# Altium schematic sheet 0113_AUDIO - SNDW2 for .SchDoc
size 848 x 558 mm
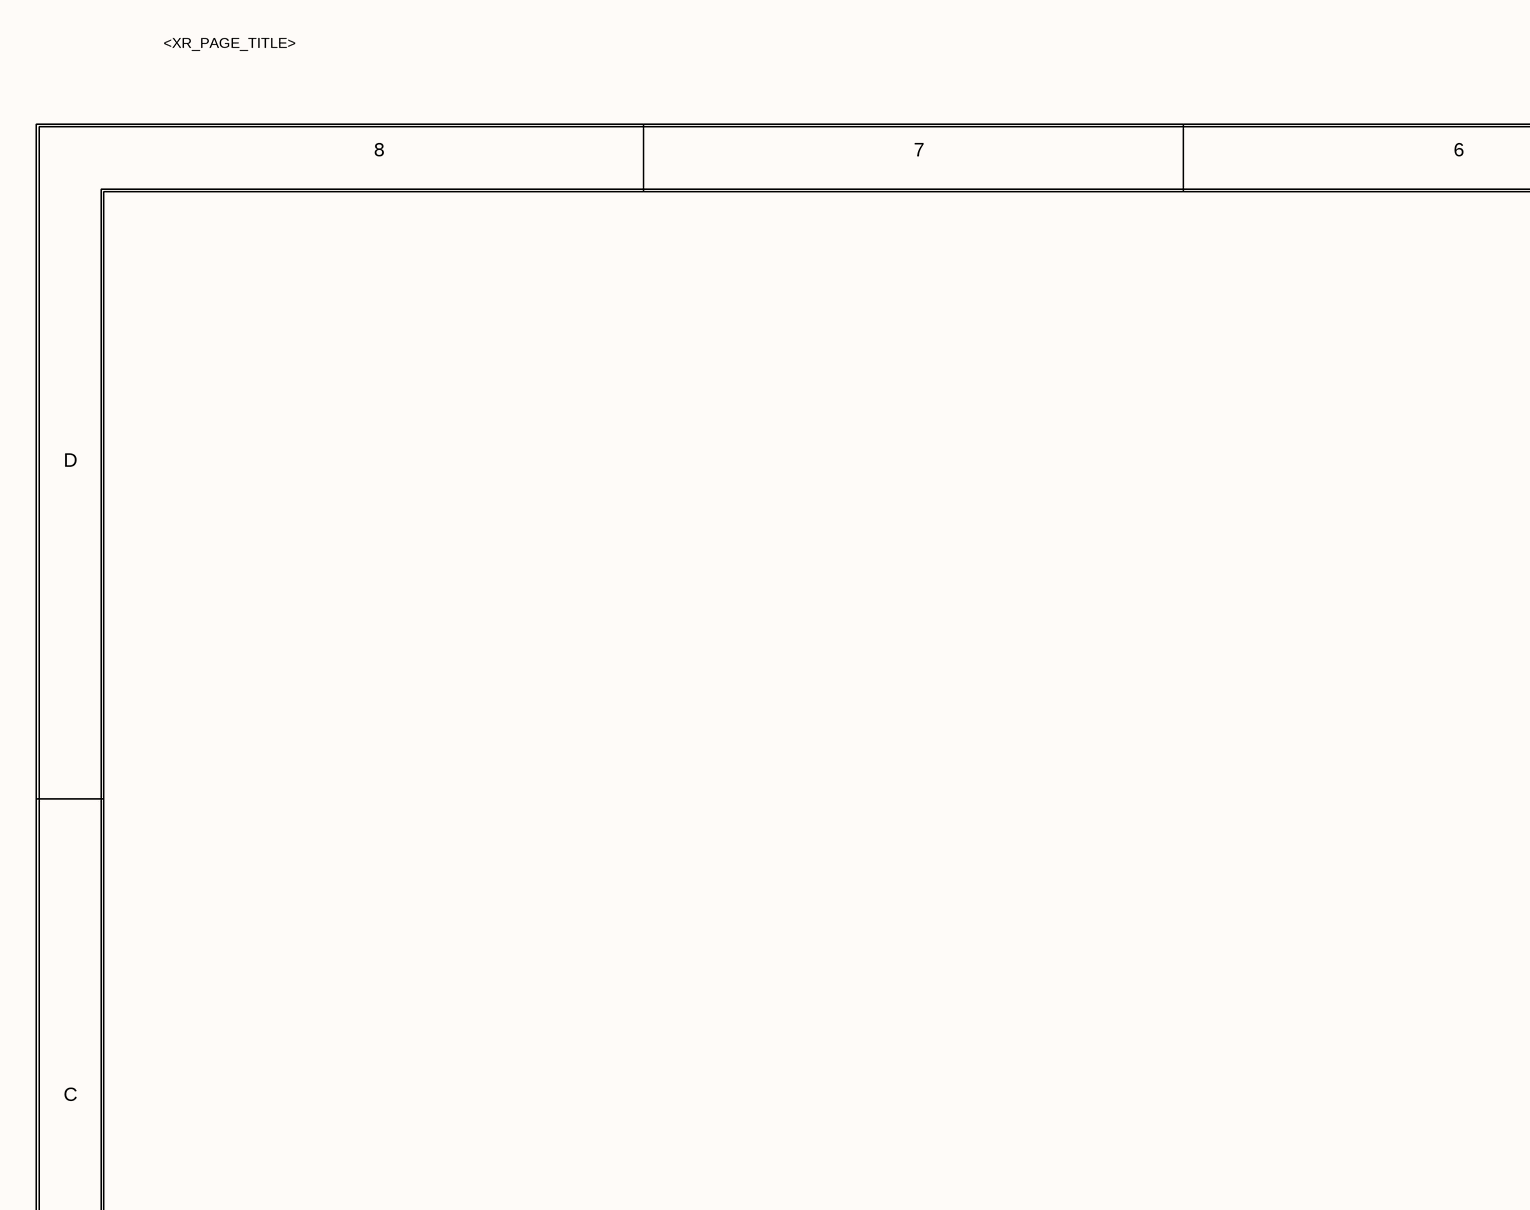
[diagram p0: 0113_AUDIO - SNDW2 for .SchDoc, top left]
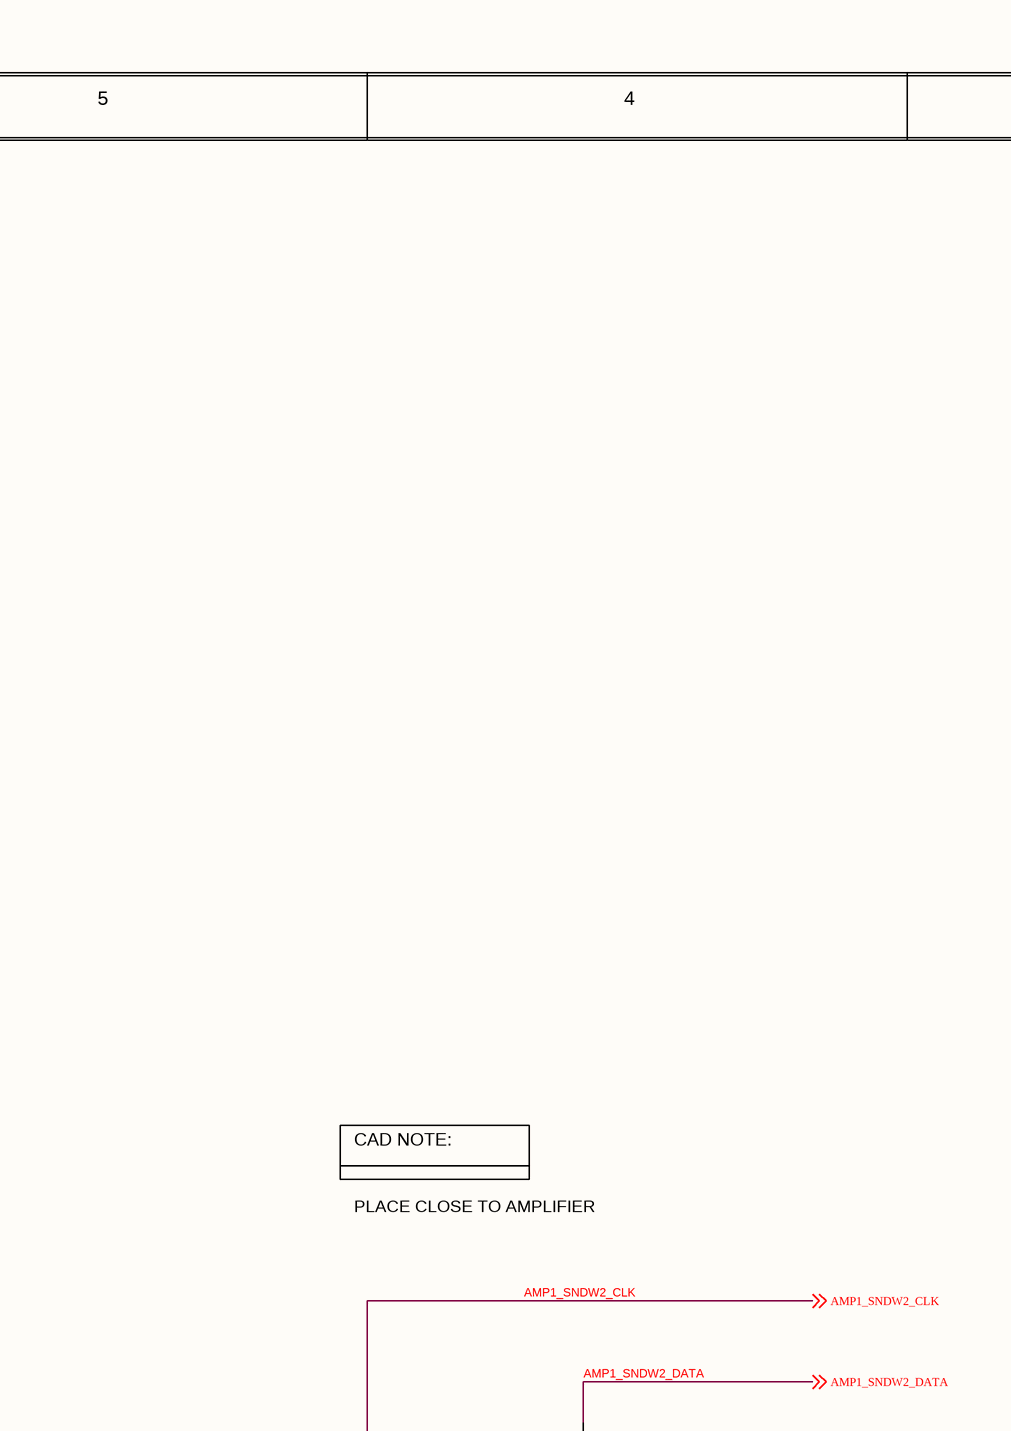
[diagram p1: 0113_AUDIO - SNDW2 for .SchDoc, top middle]
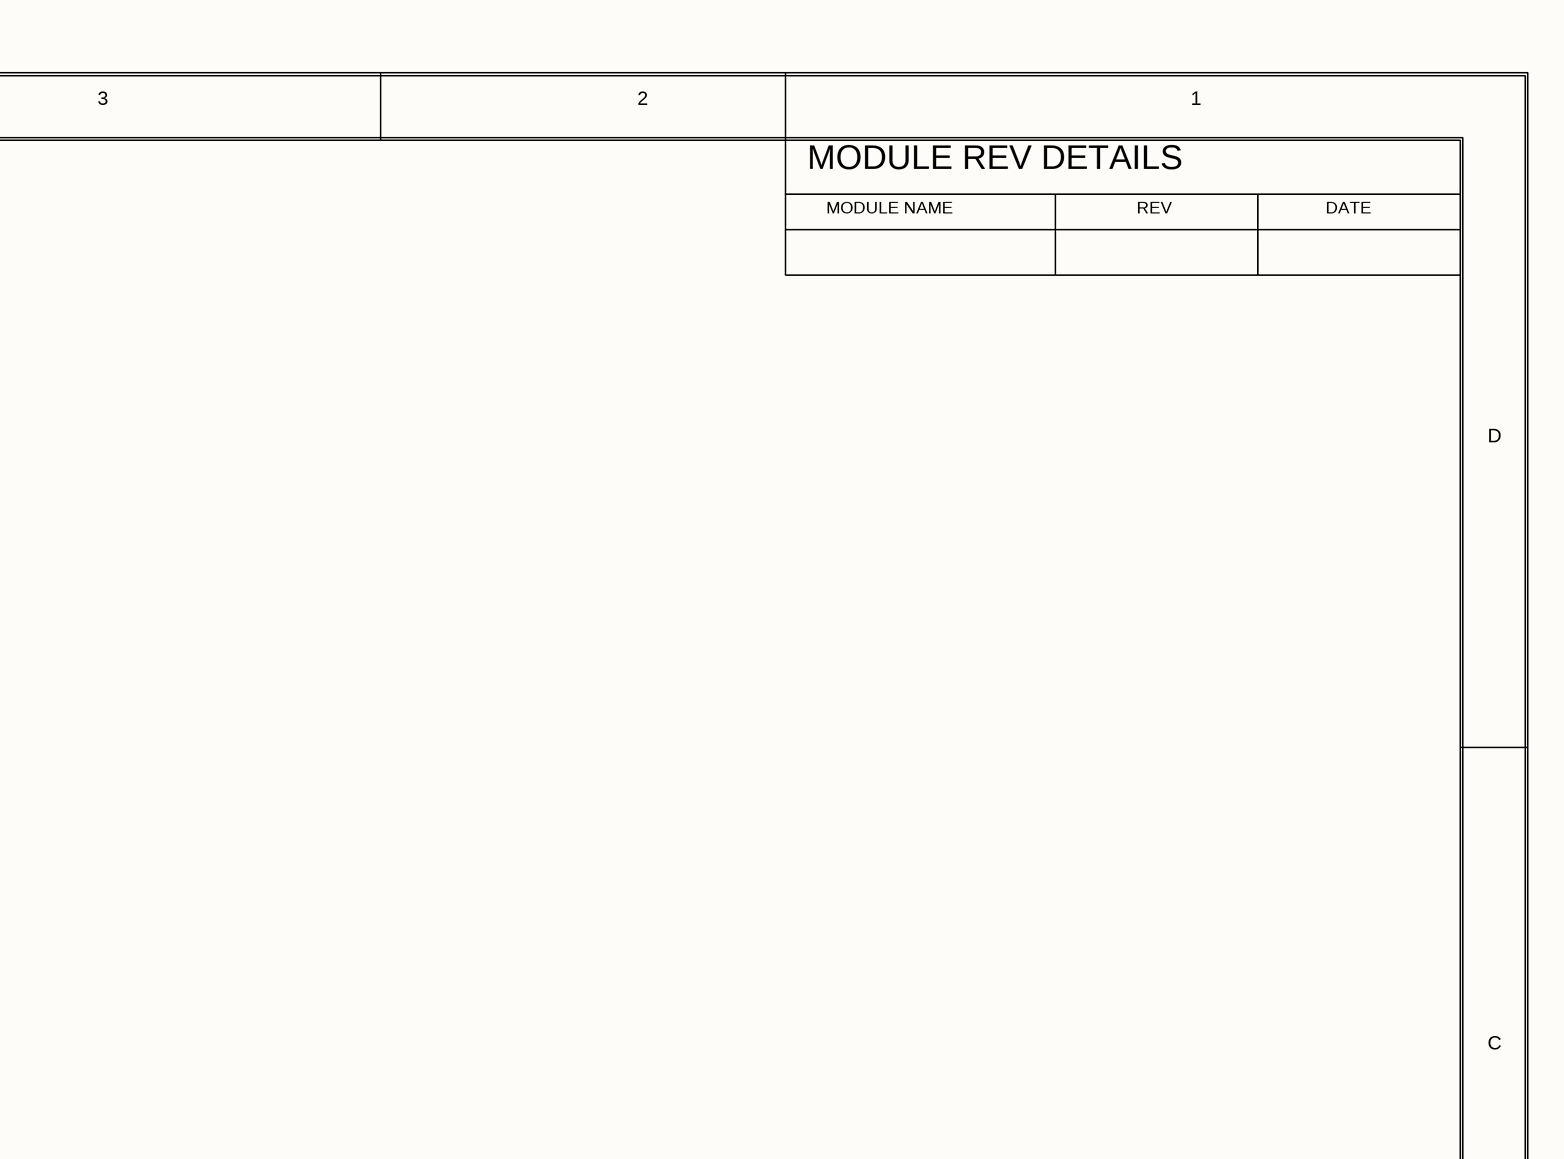
[diagram p2: 0113_AUDIO - SNDW2 for .SchDoc, top right]
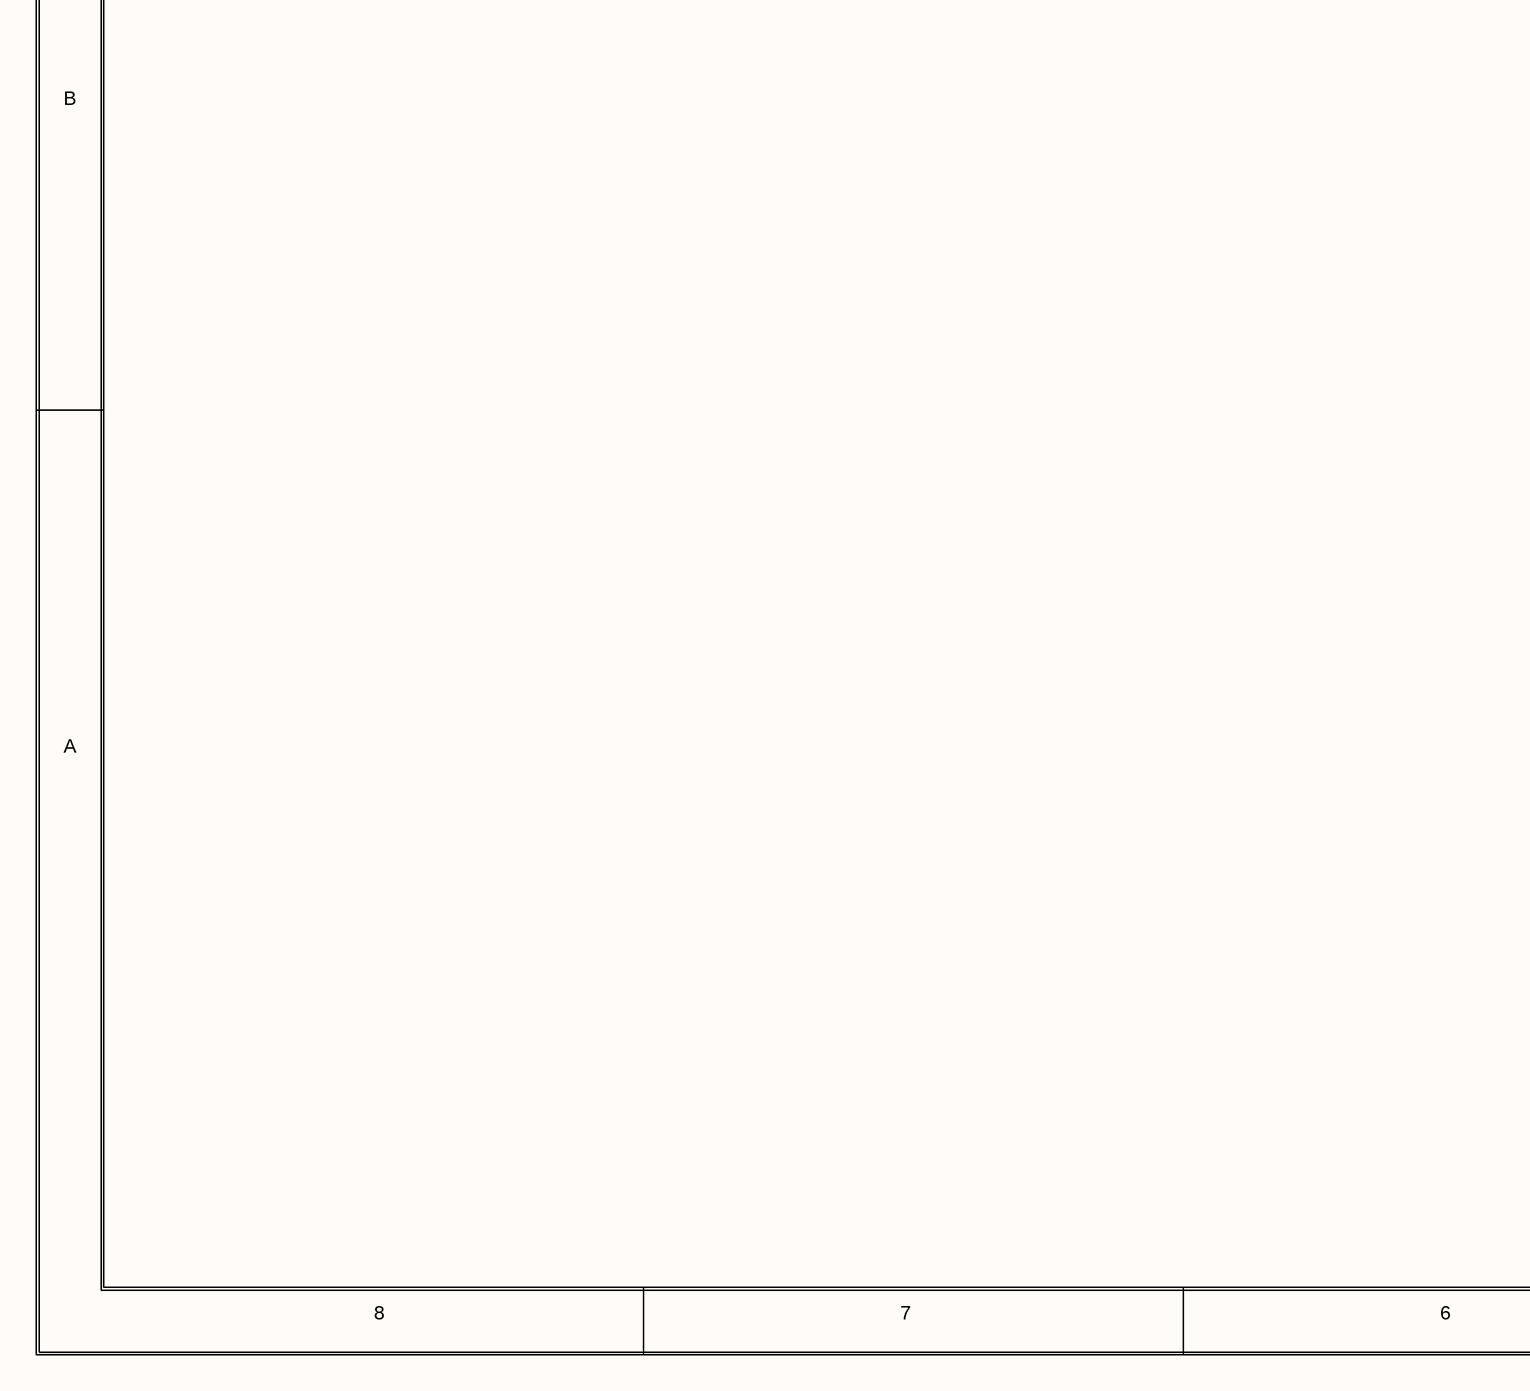
[diagram p3: 0113_AUDIO - SNDW2 for .SchDoc, bottom left]
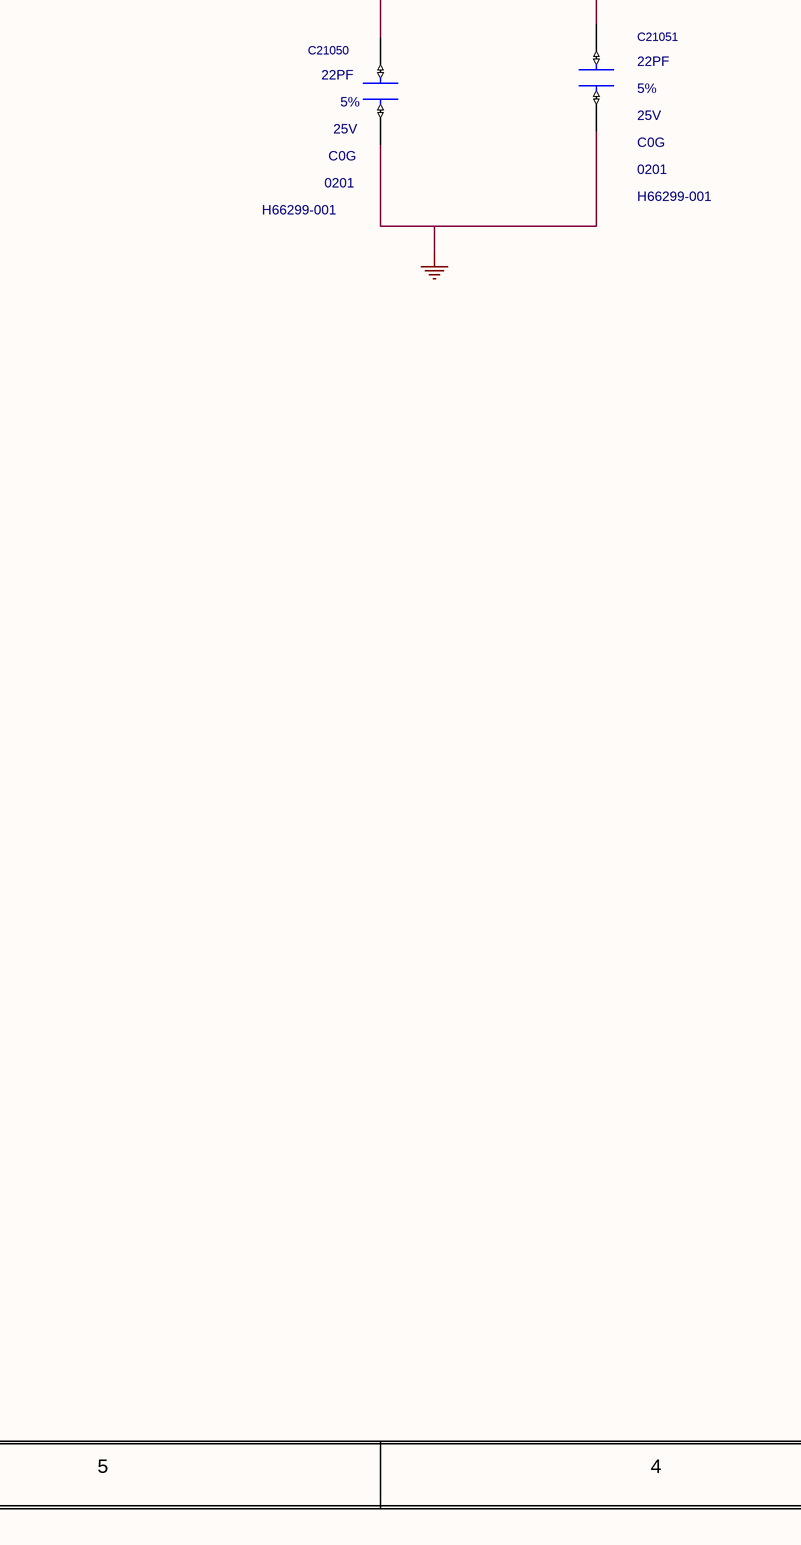
[diagram p4: 0113_AUDIO - SNDW2 for .SchDoc, bottom middle]
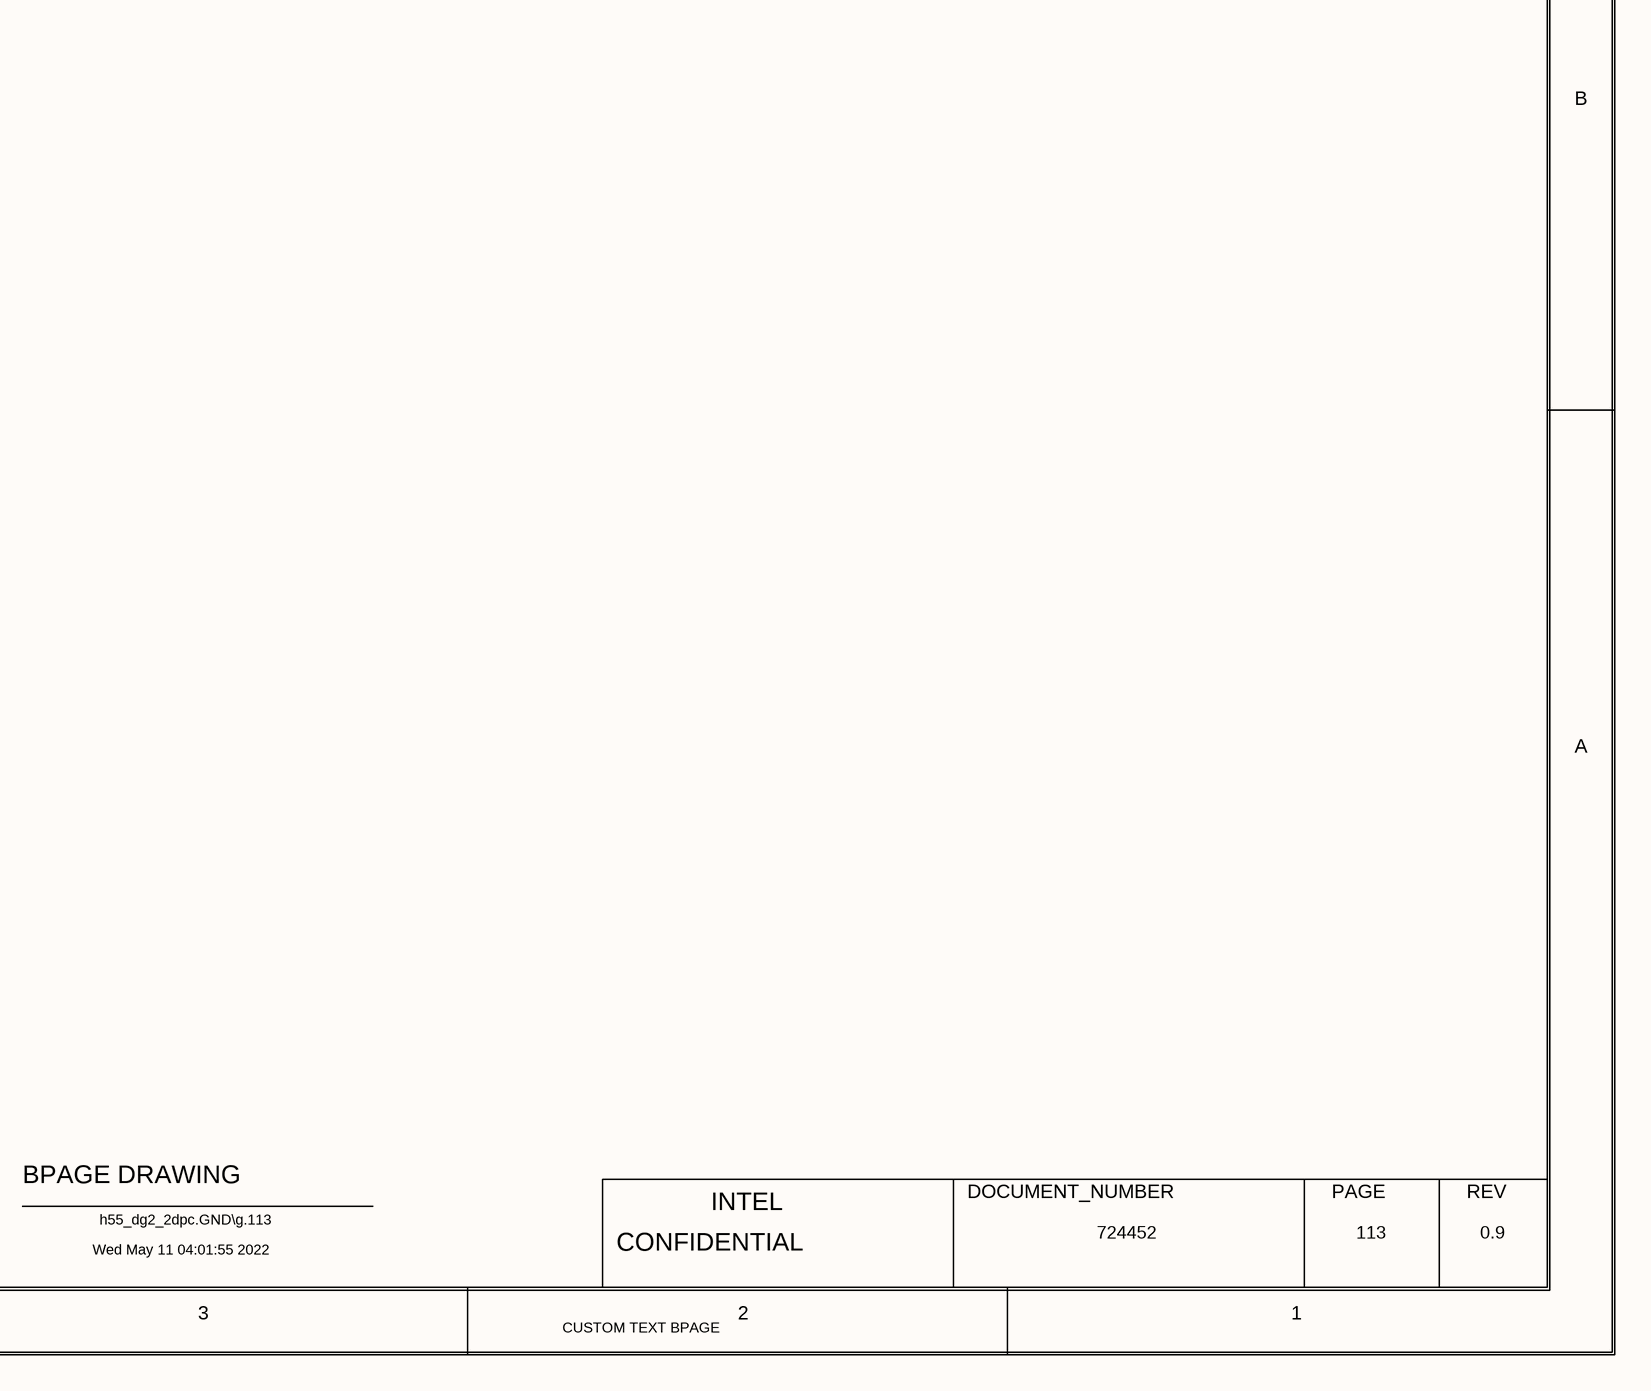
[diagram p5: 0113_AUDIO - SNDW2 for .SchDoc, bottom right]

## Parts
C21050  22PF  MATERIAL: C0G  PACK_TYPE: 0201  PART_NUMBER: H66299-001  TOLERANCE: 5%  VOLTAGE: 25V  [CTK0_SM0201_630X330_MA]
C21051  22PF  MATERIAL: C0G  PACK_TYPE: 0201  PART_NUMBER: H66299-001  TOLERANCE: 5%  VOLTAGE: 25V  [CTK0_SM0201_630X330_MA]

## Nets
GND: C21050.2(B) C21051.2(B)
AMP1_SNDW2_CLK: C21050.1(A) ; off-sheet AMP1_SNDW2_CLK
AMP1_SNDW2_DATA: C21051.1(A) ; off-sheet AMP1_SNDW2_DATA

## Notes on the sheet
- <XR_PAGE_TITLE>
- 8
- 7
- 6
- 5
- 4
- 3
- 2
- 1
- MODULE REV DETAILS
- MODULE NAME
- REV
- DATE
- D
- C
- CAD NOTE:
- PLACE CLOSE TO AMPLIFIER
- B
- A
- BPAGE DRAWING
- INTEL
- DOCUMENT_NUMBER
- PAGE
- Wed May 11 04:01:55 2022
- h55_dg2_2dpc.GND\g.113
- CONFIDENTIAL
- 724452
- 113
- 0.9
- CUSTOM TEXT BPAGE

## Library data of the parts
C21050 = C_CAP: CDS_PHYS_PART_NAME: C_CAP_0201-H66299-001,C0G,22PF,25V,5%,TK0,GENERIC; CDS_LMAN_SYM_OUTLINE: -50,50,50,-50; FP_TECH: TK0; IP: GENERIC; ROOM: NONE; OriginalSymbolOrigin: (-50,25); XY: (4700,2325); VER: 1; SUB_ROOM: DECOUPLING; ROT: 0; PHYS_PAGE: 113; LOCATION: C21050; DRAWING: @RVP1_ADL_SB_ADP_S_DDR5_SODIMM_2DPC_LIB.H55_DG2_2DPC(SCH_1):PAGE484; CDS_LIB: c_discrete; VARIANT: ?; PCB Footprint: CTK0_SM0201_630X330_MA; CHIPS_PART_NAME: C_CAP; CDS_PART_NAME: C_CAP_0201-H66299-001,C0G,22PF,25V,5%,TK0,GENERIC; CDS_LOCATION: C21050
C21051 = C_CAP: CDS_PHYS_PART_NAME: C_CAP_0201-H66299-001,C0G,22PF,25V,5%,TK0,GENERIC; CDS_LMAN_SYM_OUTLINE: -50,50,50,-50; FP_TECH: TK0; IP: GENERIC; ROOM: NONE; OriginalSymbolOrigin: (-50,25); XY: (5100,2350); VER: 1; SUB_ROOM: DECOUPLING; ROT: 2; PHYS_PAGE: 113; LOCATION: C21051; DRAWING: @RVP1_ADL_SB_ADP_S_DDR5_SODIMM_2DPC_LIB.H55_DG2_2DPC(SCH_1):PAGE484; CDS_LIB: c_discrete; VARIANT: ?; PCB Footprint: CTK0_SM0201_630X330_MA; CHIPS_PART_NAME: C_CAP; CDS_PART_NAME: C_CAP_0201-H66299-001,C0G,22PF,25V,5%,TK0,GENERIC; CDS_LOCATION: C21051